# Altium schematic sheet DB4100_DRV.SchDoc
size A4
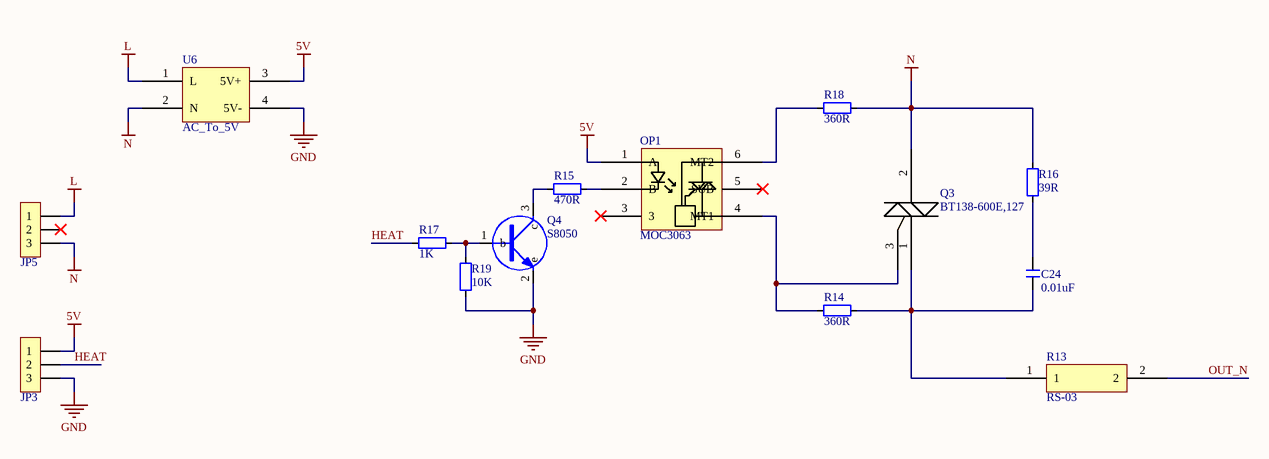
[diagram p0: DB4100_DRV.SchDoc]

## Parts
C24  0.01uF  [MLCC5.08-A]
JP3  HDR-1X3  [XH2.54-3P]  (value not drawn)
JP5  HDR-1X3  [VH3.96-3PWB]  (value not drawn)
OP1  MOC3063  [MOC3063]
Q3  BT138-600E,127  [BT138-600E,127]
Q4  S8050  [SOT23-3L]
R13  RS-03  [RS-03]
R14  360R  [R 1206]
R15  470R  [R 0603]
R16  39R  [R 1206]
R17  1K  [R 0603]
R18  360R  [R 1206]
R19  10K  [R 0603]
U6  AC_To_5V  [ACTo5v]

## Nets
5V: JP3.1 OP1.1(A) U6.3(5V+)
GND: JP3.3 Q4.2(e) R19.1 U6.4(5V-)
L: JP5.1 U6.1(L)
N: JP5.3 Q3.2 R16.1 R18.2 U6.2(N)
HEAT: JP3.2 R17.1
OUT_N: R13.2
NetC24_1: C24.1 R16.2
NetC24_2: C24.2 Q3.1 R13.1 R14.2
NetOP1_2: OP1.2(B) R15.2
NetOP1_4: OP1.4(MT1) Q3.3 R14.1
NetOP1_6: OP1.6(MT2) R18.1
NetQ4_1: Q4.1(b) R17.2 R19.2
NetQ4_3: Q4.3(c) R15.1

Not connected (* = marked no-connect by the designer): JP5 2*; OP1 3* 5(SUB)*

## Library data of the parts
C24 = C-MLCC: 独石电容; 版权归属: 源创客; BOM名称: 独石电容; 学习资源: www.ooocke.com
JP3 JP5 = Header 3: 3P接插件; 版权归属: 源创客; BOM名称: 3P接插件; 学习资源: www.ooocke.com
OP1 = MOC3063: 双向可控硅
Q3 = BT138-600E,127: 晶闸管(可控硅)/模块
Q4 = NPN
R13 = RS-03: 电吹风热保护器
R14-R19 = R: 贴片电阻; 版权归属: 源创客; BOM名称: 贴片电阻; 学习资源: www.ooocke.com
U6 = AC_To_5V: 220V转5V降压模块